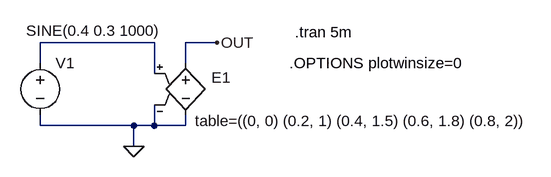
[diagram p0: schematic Fig_2-72_E1_Table.asc]
Fig_2-72_E1_Table.asc, the LTspice schematic file:
Version 4
SHEET 1 880 680
WIRE 128 128 -48 128
WIRE 224 128 176 128
WIRE -48 160 -48 128
WIRE 176 160 176 128
WIRE 128 176 128 128
WIRE -48 256 -48 240
WIRE 96 256 -48 256
WIRE 128 256 128 224
WIRE 128 256 96 256
WIRE 176 256 176 240
WIRE 176 256 128 256
WIRE 96 288 96 256
FLAG 96 288 0
FLAG 224 128 OUT
SYMBOL e 176 144 R0
WINDOW 3 14 105 Left 2
WINDOW 0 40 38 Left 2
SYMATTR Value table=((0, 0) (0.2, 1) (0.4, 1.5) (0.6, 1.8) (0.8, 2))
SYMATTR InstName E1
SYMBOL voltage -48 144 R0
WINDOW 3 -22 -34 Left 2
WINDOW 123 0 0 Left 2
WINDOW 39 0 0 Left 2
SYMATTR Value SINE(0.4 0.3 1000)
SYMATTR InstName V1
TEXT 344 112 Left 2 !.tran 5m
TEXT 336 160 Left 2 !.OPTIONS plotwinsize=0

The netlist it stands for:
* Fig_2-72_E1_Table.asc
E1 OUT 0 N001 0 table=((0, 0) (0.2, 1) (0.4, 1.5) (0.6, 1.8) (0.8, 2))
V1 N001 0 SINE(0.4 0.3 1000)
.tran 5m
.OPTIONS plotwinsize=0
.backanno
.end